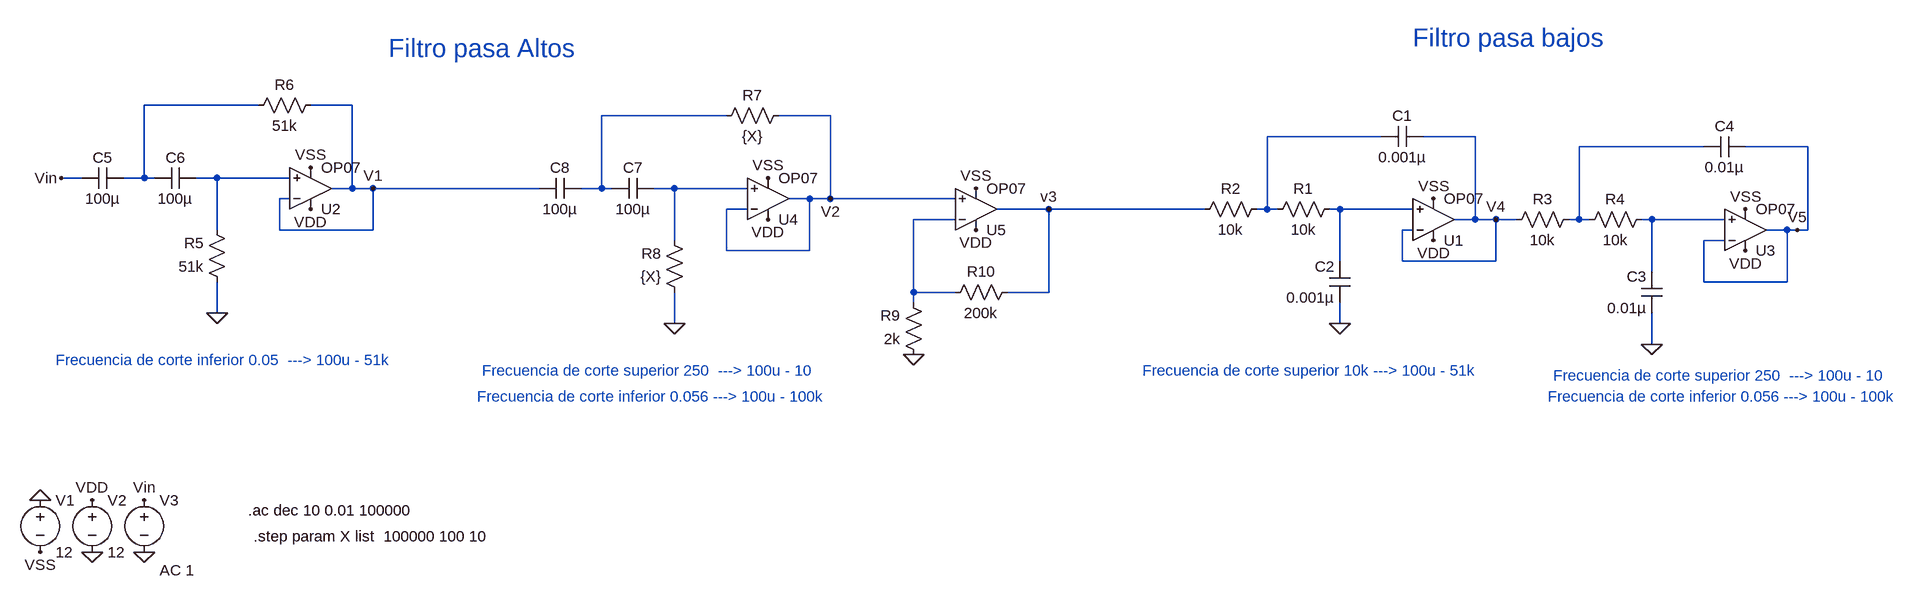
[diagram p0: schematic pb.asc]
pb.asc, the LTspice schematic file:
Version 4
SHEET 1 1104 680
WIRE -2784 -608 -2960 -608
WIRE -2640 -608 -2704 -608
WIRE -2064 -592 -2256 -592
WIRE -1904 -592 -1984 -592
WIRE -1056 -560 -1232 -560
WIRE -912 -560 -992 -560
WIRE -560 -544 -752 -544
WIRE -400 -544 -496 -544
WIRE -3056 -496 -3088 -496
WIRE -2960 -496 -2960 -608
WIRE -2960 -496 -2992 -496
WIRE -2944 -496 -2960 -496
WIRE -2848 -496 -2880 -496
WIRE -2736 -496 -2848 -496
WIRE -2640 -480 -2640 -608
WIRE -2640 -480 -2672 -480
WIRE -2608 -480 -2640 -480
WIRE -2352 -480 -2608 -480
WIRE -2256 -480 -2256 -592
WIRE -2256 -480 -2288 -480
WIRE -2240 -480 -2256 -480
WIRE -2144 -480 -2176 -480
WIRE -2032 -480 -2144 -480
WIRE -2736 -464 -2752 -464
WIRE -1936 -464 -1968 -464
WIRE -1904 -464 -1904 -592
WIRE -1904 -464 -1936 -464
WIRE -1712 -464 -1904 -464
WIRE -2032 -448 -2064 -448
WIRE -1568 -448 -1648 -448
WIRE -1328 -448 -1568 -448
WIRE -1232 -448 -1232 -560
WIRE -1232 -448 -1248 -448
WIRE -1216 -448 -1232 -448
WIRE -1120 -448 -1136 -448
WIRE -1008 -448 -1120 -448
WIRE -1712 -432 -1776 -432
WIRE -912 -432 -912 -560
WIRE -912 -432 -944 -432
WIRE -880 -432 -912 -432
WIRE -848 -432 -880 -432
WIRE -752 -432 -752 -544
WIRE -752 -432 -768 -432
WIRE -736 -432 -752 -432
WIRE -640 -432 -656 -432
WIRE -528 -432 -640 -432
WIRE -2848 -416 -2848 -496
WIRE -2752 -416 -2752 -464
WIRE -2608 -416 -2608 -480
WIRE -2608 -416 -2752 -416
WIRE -1008 -416 -1024 -416
WIRE -432 -416 -464 -416
WIRE -416 -416 -432 -416
WIRE -400 -416 -400 -544
WIRE -400 -416 -416 -416
WIRE -2144 -400 -2144 -480
WIRE -528 -400 -560 -400
WIRE -2064 -384 -2064 -448
WIRE -1936 -384 -1936 -464
WIRE -1936 -384 -2064 -384
WIRE -1120 -368 -1120 -448
WIRE -1024 -368 -1024 -416
WIRE -880 -368 -880 -432
WIRE -880 -368 -1024 -368
WIRE -640 -352 -640 -432
WIRE -560 -336 -560 -400
WIRE -432 -336 -432 -416
WIRE -432 -336 -560 -336
WIRE -1776 -320 -1776 -432
WIRE -1712 -320 -1776 -320
WIRE -1568 -320 -1568 -448
WIRE -1568 -320 -1632 -320
WIRE -1776 -304 -1776 -320
WIRE -2848 -288 -2848 -336
WIRE -2144 -272 -2144 -320
WIRE -1120 -272 -1120 -304
WIRE -640 -240 -640 -288
FLAG -1120 -272 0
FLAG -640 -240 0
FLAG -976 -400 VDD
FLAG -496 -384 VDD
FLAG -976 -464 VSS
FLAG -496 -448 VSS
FLAG -3120 0 0
FLAG -3040 80 0
FLAG -2960 80 0
FLAG -3040 0 VDD
FLAG -3120 80 VSS
FLAG -2960 0 Vin
FLAG -2848 -288 0
FLAG -2144 -272 0
FLAG -2704 -448 VDD
FLAG -2000 -432 VDD
FLAG -2704 -512 VSS
FLAG -2000 -496 VSS
FLAG -3088 -496 Vin
FLAG -1904 -464 V2
FLAG -2608 -480 V1
FLAG -1680 -416 VDD
FLAG -1680 -480 VSS
FLAG -1776 -224 0
FLAG -1568 -448 v3
FLAG -880 -432 V4
FLAG -416 -416 V5
SYMBOL Opamps\\OP07 -976 -368 M180
SYMATTR InstName U1
SYMBOL cap -992 -576 R90
WINDOW 0 0 32 VBottom 2
WINDOW 3 32 32 VTop 2
SYMATTR InstName C1
SYMATTR Value 0.001µ
SYMBOL cap -1104 -304 R180
WINDOW 0 24 56 Left 2
WINDOW 3 24 8 Left 2
SYMATTR InstName C2
SYMATTR Value 0.001µ
SYMBOL res -1120 -464 R90
WINDOW 0 0 56 VBottom 2
WINDOW 3 32 56 VTop 2
SYMATTR InstName R1
SYMATTR Value 10k
SYMBOL res -1232 -464 R90
WINDOW 0 0 56 VBottom 2
WINDOW 3 32 56 VTop 2
SYMATTR InstName R2
SYMATTR Value 10k
SYMBOL Opamps\\OP07 -496 -352 M180
SYMATTR InstName U3
SYMBOL cap -624 -288 R180
WINDOW 0 24 56 Left 2
WINDOW 3 24 8 Left 2
SYMATTR InstName C3
SYMATTR Value 0.01µ
SYMBOL cap -496 -560 R90
WINDOW 0 0 32 VBottom 2
WINDOW 3 32 32 VTop 2
SYMATTR InstName C4
SYMATTR Value 0.01µ
SYMBOL res -752 -448 R90
WINDOW 0 0 56 VBottom 2
WINDOW 3 32 56 VTop 2
SYMATTR InstName R3
SYMATTR Value 10k
SYMBOL res -640 -448 R90
WINDOW 0 0 56 VBottom 2
WINDOW 3 32 56 VTop 2
SYMATTR InstName R4
SYMATTR Value 10k
SYMBOL voltage -3120 -16 R0
WINDOW 123 0 0 Left 2
WINDOW 39 0 0 Left 2
SYMATTR InstName V1
SYMATTR Value 12
SYMBOL voltage -3040 -16 R0
WINDOW 123 0 0 Left 2
WINDOW 39 0 0 Left 2
SYMATTR InstName V2
SYMATTR Value 12
SYMBOL voltage -2960 -16 R0
WINDOW 123 24 124 Left 2
WINDOW 39 0 0 Left 2
SYMATTR Value2 AC 1
SYMATTR InstName V3
SYMATTR Value ""
SYMBOL Opamps\\OP07 -2704 -416 M180
SYMATTR InstName U2
SYMBOL cap -2992 -512 R90
WINDOW 0 0 32 VBottom 2
WINDOW 3 32 32 VTop 2
SYMATTR InstName C5
SYMATTR Value 100µ
SYMBOL cap -2944 -480 R270
WINDOW 0 32 32 VTop 2
WINDOW 3 0 32 VBottom 2
SYMATTR InstName C6
SYMATTR Value 100µ
SYMBOL res -2832 -320 R180
WINDOW 0 36 76 Left 2
WINDOW 3 36 40 Left 2
SYMATTR InstName R5
SYMATTR Value 51k
SYMBOL res -2688 -624 R90
WINDOW 0 0 56 VBottom 2
WINDOW 3 32 56 VTop 2
SYMATTR InstName R6
SYMATTR Value 51k
SYMBOL Opamps\\OP07 -2000 -400 M180
SYMATTR InstName U4
SYMBOL cap -2240 -464 R270
WINDOW 0 32 32 VTop 2
WINDOW 3 0 32 VBottom 2
SYMATTR InstName C7
SYMATTR Value 100µ
SYMBOL cap -2288 -496 R90
WINDOW 0 0 32 VBottom 2
WINDOW 3 32 32 VTop 2
SYMATTR InstName C8
SYMATTR Value 100µ
SYMBOL res -1968 -608 R90
WINDOW 0 0 56 VBottom 2
WINDOW 3 32 56 VTop 2
SYMATTR InstName R7
SYMATTR Value {X}
SYMBOL res -2128 -304 R180
WINDOW 0 36 76 Left 2
WINDOW 3 36 40 Left 2
SYMATTR InstName R8
SYMATTR Value {X}
SYMBOL Opamps\\OP07 -1680 -384 M180
SYMATTR InstName U5
SYMBOL res -1760 -208 R180
WINDOW 0 36 76 Left 2
WINDOW 3 36 40 Left 2
SYMATTR InstName R9
SYMATTR Value 2k
SYMBOL res -1616 -336 R90
WINDOW 0 0 56 VBottom 2
WINDOW 3 32 56 VTop 2
SYMATTR InstName R10
SYMATTR Value 200k
TEXT -2800 16 Left 2 !.ac dec 10 0.01 100000
TEXT -2792 56 Left 2 !.step param X list  100000 100 10
TEXT -3096 -216 Left 2 ;Frecuencia de corte inferior 0.05  ---> 100u - 51k
TEXT -2440 -200 Left 2 ;Frecuencia de corte superior 250  ---> 100u - 10
TEXT -2448 -160 Left 2 ;Frecuencia de corte inferior 0.056 ---> 100u - 100k
TEXT -2584 -696 Left 4 ;Filtro pasa Altos
TEXT -1008 -712 Left 4 ;Filtro pasa bajos
TEXT -1424 -200 Left 2 ;Frecuencia de corte superior 10k ---> 100u - 51k
TEXT -792 -192 Left 2 ;Frecuencia de corte superior 250  ---> 100u - 10
TEXT -800 -160 Left 2 ;Frecuencia de corte inferior 0.056 ---> 100u - 100k

The netlist it stands for:
* pb.asc
XU1 N007 V4 VDD VSS V4 LT1001  ; OP07, pins In+ In- V+ V- OUT
C1 V4 N003 0.001µ
C2 0 N007 0.001µ
R1 N007 N003 10k
R2 N003 v3 10k
XU3 N009 V5 VDD VSS V5 LT1001  ; OP07, pins In+ In- V+ V- OUT
C3 0 N009 0.01µ
C4 V5 N004 0.01µ
R3 N004 V4 10k
R4 N009 N004 10k
V1 0 VSS 12
V2 VDD 0 12
V3 Vin 0 AC 1
XU2 N005 V1 VDD VSS V1 LT1001  ; OP07, pins In+ In- V+ V- OUT
C5 N001 Vin 100µ
C6 N001 N005 100µ
R5 0 N005 51k
R6 V1 N001 51k
XU4 N006 V2 VDD VSS V2 LT1001  ; OP07, pins In+ In- V+ V- OUT
C7 N002 N006 100µ
C8 N002 V1 100µ
R7 V2 N002 {X}
R8 0 N006 {X}
XU5 V2 N008 VDD VSS v3 LT1001  ; OP07, pins In+ In- V+ V- OUT
R9 0 N008 2k
R10 v3 N008 200k
.ac dec 10 0.01 100000
.step param X list  100000 100 10
* Frecuencia de corte inferior 0.05  ---> 100u - 51k
* Frecuencia de corte superior 250  ---> 100u - 10
* Frecuencia de corte inferior 0.056 ---> 100u - 100k
* Filtro pasa Altos
* Filtro pasa bajos
* Frecuencia de corte superior 10k ---> 100u - 51k
* Frecuencia de corte superior 250  ---> 100u - 10
* Frecuencia de corte inferior 0.056 ---> 100u - 100k
.lib LTC.lib
.backanno
.end

* Results of the author's LTspice run, read from the files saved beside the schematic
* Operating Point (first step), zero values left out:
*   x = 100 k
*   V(vdd) = 12 V
*   V(vss) = -12 V
*   I(V2) = -11.25 mA
*   I(V1) = -11.25 mA
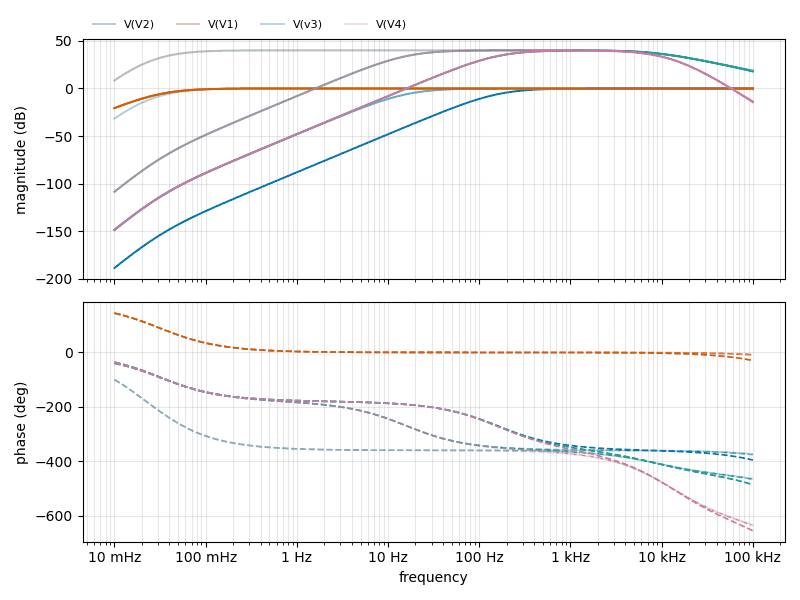
[diagram p1: AC Analysis of pb.asc, plotted from the saved traces]
* AC Analysis, 3 runs:
*   V(V2) [run 1]: -31.58 dB at 10 mHz, 0.07 dB at 100 kHz, peak 0.07 dB at 100 kHz, 3 dB below the peak at 57.5 mHz
*   V(V2) [run 2]: -148.69 dB at 10 mHz, 0.06 dB at 100 kHz, peak 0.06 dB at 100 kHz, 3 dB below the peak at 25.03 Hz
*   V(V2) [run 3]: -188.66 dB at 10 mHz, -0.73 dB at 100 kHz, peak 0.00 dB at 7.943 kHz, 3 dB below the peak at 247.4 Hz
*   V(V1) [run 1]: -20.62 dB at 10 mHz, 0.04 dB at 100 kHz, peak 0.04 dB at 100 kHz, 3 dB below the peak at 49.01 mHz
*   V(V1) [run 2]: -20.62 dB at 10 mHz, 0.06 dB at 100 kHz, peak 0.06 dB at 100 kHz, 3 dB below the peak at 49.22 mHz
*   V(V1) [run 3]: -20.62 dB at 10 mHz, -0.41 dB at 100 kHz, peak 0.01 dB at 1.585 kHz, 3 dB below the peak at 48.74 mHz
*   V(v3) [run 1]: 8.50 dB at 10 mHz, 18.68 dB at 100 kHz, peak 40.09 dB at 19.95 Hz, 3 dB below the peak at 56.74 mHz and 8.473 kHz
*   V(v3) [run 2]: -108.61 dB at 10 mHz, 18.66 dB at 100 kHz, peak 40.06 dB at 398.1 Hz, 3 dB below the peak at 24.68 Hz and 8.516 kHz
*   V(v3) [run 3]: -148.58 dB at 10 mHz, 17.88 dB at 100 kHz, peak 39.86 dB at 1.259 kHz, 3 dB below the peak at 238.3 Hz and 8.898 kHz
*   V(V4) [run 1]: 8.50 dB at 10 mHz, -13.60 dB at 100 kHz, peak 40.09 dB at 19.95 Hz, 3 dB below the peak at 56.74 mHz and 6.116 kHz
*   V(V4) [run 2]: -108.61 dB at 10 mHz, -13.61 dB at 100 kHz, peak 40.06 dB at 398.1 Hz, 3 dB below the peak at 24.66 Hz and 6.154 kHz
*   V(V4) [run 3]: -148.58 dB at 10 mHz, -14.40 dB at 100 kHz, peak 39.81 dB at 1.259 kHz, 3 dB below the peak at 236.2 Hz and 6.442 kHz